# EAGLE design WiFiLedBoard (EAGLE 6.1)
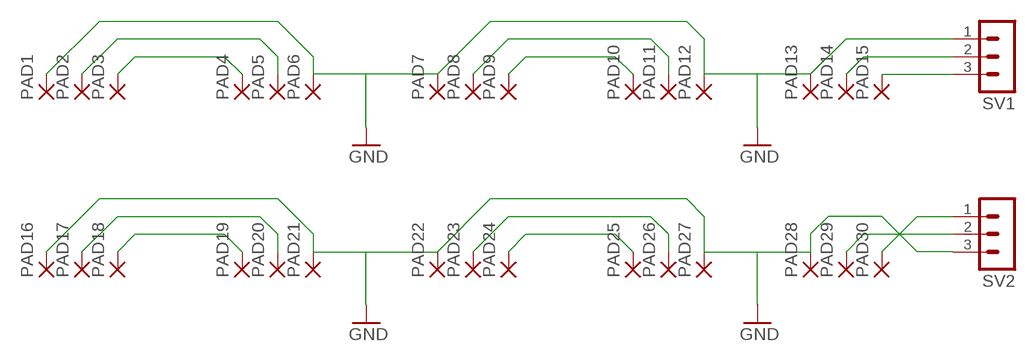
[diagram p0: schematic, sheet 1]

## Parts
PAD1  SMD2  [SMD1,27-2,54]
PAD2  SMD2  [SMD1,27-2,54]
PAD3  SMD2  [SMD1,27-2,54]
PAD4  SMD2  [SMD1,27-2,54]
PAD5  SMD2  [SMD1,27-2,54]
PAD6  SMD2  [SMD1,27-2,54]
PAD7  SMD2  [SMD1,27-2,54]
PAD8  SMD2  [SMD1,27-2,54]
PAD9  SMD2  [SMD1,27-2,54]
PAD10  SMD2  [SMD1,27-2,54]
PAD11  SMD2  [SMD1,27-2,54]
PAD12  SMD2  [SMD1,27-2,54]
PAD13  SMD2  [SMD1,27-2,54]
PAD14  SMD2  [SMD1,27-2,54]
PAD15  SMD2  [SMD1,27-2,54]
PAD16  SMD2  [SMD1,27-2,54]
PAD17  SMD2  [SMD1,27-2,54]
PAD18  SMD2  [SMD1,27-2,54]
PAD19  SMD2  [SMD1,27-2,54]
PAD20  SMD2  [SMD1,27-2,54]
PAD21  SMD2  [SMD1,27-2,54]
PAD22  SMD2  [SMD1,27-2,54]
PAD23  SMD2  [SMD1,27-2,54]
PAD24  SMD2  [SMD1,27-2,54]
PAD25  SMD2  [SMD1,27-2,54]
PAD26  SMD2  [SMD1,27-2,54]
PAD27  SMD2  [SMD1,27-2,54]
PAD28  SMD2  [SMD1,27-2,54]
PAD29  SMD2  [SMD1,27-2,54]
PAD30  SMD2  [SMD1,27-2,54]
SV1  MA03-1  [MA03-1]
SV2  MA03-1  [MA03-1]

## Nets
GND: PAD1.1(P) PAD6.1(P) PAD7.1(P) PAD12.1(P) PAD13.1(P) PAD16.1(P) PAD21.1(P) PAD22.1(P) PAD27.1(P) PAD28.1(P) SV1.1 SV2.3
N$1: PAD3.1(P) PAD4.1(P)
N$2: PAD2.1(P) PAD5.1(P)
N$4: PAD9.1(P) PAD10.1(P)
N$5: PAD8.1(P) PAD11.1(P)
N$7: PAD14.1(P) SV1.2
N$8: PAD29.1(P) SV2.2
N$9: PAD30.1(P) SV2.1
N$10: PAD18.1(P) PAD19.1(P)
N$11: PAD17.1(P) PAD20.1(P)
N$13: PAD24.1(P) PAD25.1(P)
N$14: PAD23.1(P) PAD26.1(P)
N$17: PAD15.1(P) SV1.3

## Library data of the parts
PAD1-PAD30 = wirepad:SMD2: SMD PAD
SV1 SV2 = con-lstb:MA03-1: PIN HEADER; OC_FARNELL: unknown; OC_NEWARK: unknown

## Board
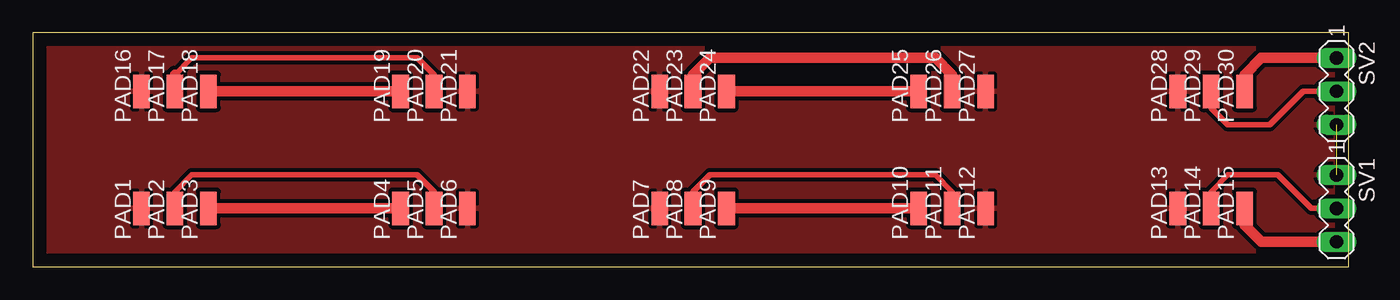
[diagram p1: board, top side]

Size 100 x 17.77 mm. Coordinates in mm from the lower left corner, seen from the top.
Outline: 0,0 100,0 100,17.77 0,17.77 0,0
Copper layers (1*16): Top 0.035mm / dielectric 1.5mm / Bottom 0.035mm
Design rules: minimum track width 10mil, minimum drill 24mil, track to track 12mil, track to pad 12mil, pad to pad 8mil, via to via 8mil, smd to smd 8mil, copper to edge 40mil, drill to drill 8mil, minimum pad ring 10mil, minimum via ring 8mil, stop-mask expansion 4mil, vias tented up to drill 0mil, thermal gap 10mil

### Footprints (pad centres in the part's own frame; a part is rotated, then mirrored left to right if it is on the bottom)
SMD1,27-2,54 = smd 1.27 x 2.54: 1 0,0
MA03-1 = drill 1.016 long: 1 -2.54,0; 2 0,0; 3 2.54,0

### Placement (x,y rotation side)
PAD1  8.26,4.45 0 top
PAD2  10.79,4.45 0 top
PAD3  13.34,4.45 0 top
PAD4  27.94,4.45 0 top
PAD5  30.48,4.45 0 top
PAD6  33.02,4.45 0 top
PAD7  47.62,4.45 0 top
PAD8  50.16,4.45 0 top
PAD9  52.7,4.45 0 top
PAD10  67.31,4.45 0 top
PAD11  69.85,4.45 0 top
PAD12  72.39,4.45 0 top
PAD13  87,4.45 0 top
PAD14  89.53,4.45 0 top
PAD15  92.08,4.45 0 top
PAD16  8.26,13.34 0 top
PAD17  10.79,13.34 0 top
PAD18  13.34,13.34 0 top
PAD19  27.94,13.34 0 top
PAD20  30.48,13.34 0 top
PAD21  33.02,13.34 0 top
PAD22  47.62,13.34 0 top
PAD23  50.16,13.34 0 top
PAD24  52.7,13.34 0 top
PAD25  67.31,13.34 0 top
PAD26  69.85,13.34 0 top
PAD27  72.39,13.34 0 top
PAD28  87,13.34 0 top
PAD29  89.53,13.34 0 top
PAD30  92.08,13.34 0 top
SV1  99.06,4.45 270 top
SV2  99.06,13.34 270 top

### Tracks (layer width: path | path; a pad name or v marks a point on that pad's centre or on a via)
GND  (1 unrouted)
  pour Top: 0,17.78 0,0 100.33,0 100.33,17.78
N$1
  Top 0.813: PAD3.1 PAD4.1
N$2
  Top 0.406: PAD2.1 10.79,5.71 12.06,6.99 29.21,6.99 30.48,5.71 PAD5.1
N$4
  Top 0.813: PAD9.1 PAD10.1
N$5
  Top 0.406: PAD8.1 50.16,5.71 51.44,6.99 68.58,6.99 69.85,5.71 PAD11.1
N$7
  Top 0.406: PAD14.1 89.53,5.71 90.81,6.99 94.61,6.99 97.16,4.45 SV1.2
N$8
  Top 0.406: PAD29.1 89.53,12.06 90.81,10.79 93.98,10.79 96.52,13.34 SV2.2
N$9
  Top 0.406: PAD30.1 92.08,14.61
  Top 0.813: 92.08,14.61 93.34,15.88 SV2.1
N$10
  Top 0.813: PAD18.1 PAD19.1
N$11
  Top 0.406: 10.79,14.61 12.06,15.88 29.21,15.88 30.48,14.61 PAD20.1
  Top 0.813: PAD17.1 10.79,14.61
N$13
  Top 0.813: PAD24.1 PAD25.1
N$14
  Top 0.406: PAD23.1 50.16,14.61 | 69.85,14.61 PAD26.1
  Top 0.813: 50.16,14.61 51.44,15.88 68.58,15.88 69.85,14.61
N$17
  Top 0.406: 92.08,3.17 PAD15.1
  Top 0.813: SV1.3 93.34,1.91 92.08,3.17